# EAGLE design LEDBoard (EAGLE 7.5.0)
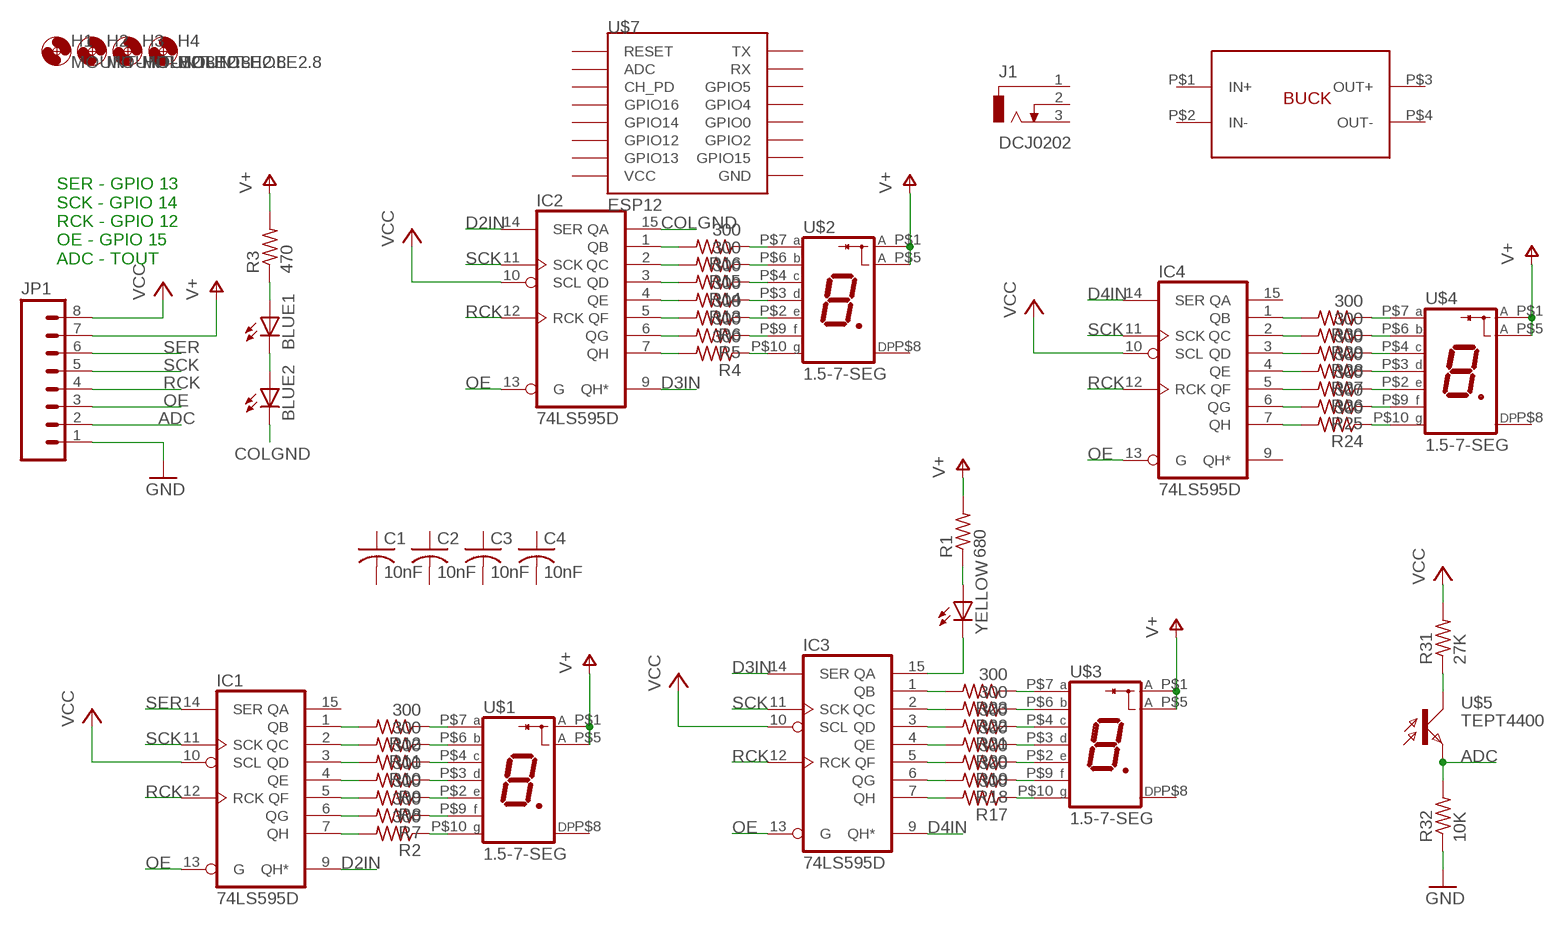
[diagram p0: schematic, sheet 1]

## Parts
BLUE1  LED3MM  [LED3MM]
BLUE2  LED3MM  [LED3MM]
C1  10nF  C-USC0805K  [C0805K]
C2  10nF  C-USC0805K  [C0805K]
C3  10nF  C-USC0805K  [C0805K]
C4  10nF  C-USC0805K  [C0805K]
H1  MOUNT-HOLE2.8  [2,8]
H2  MOUNT-HOLE2.8  [2,8]
H3  MOUNT-HOLE2.8  [2,8]
H4  MOUNT-HOLE2.8  [2,8]
IC1  74LS595D  [SO16]
IC2  74LS595D  [SO16]
IC3  74LS595D  [SO16]
IC4  74LS595D  [SO16]
J1  DCJ0202  [DCJ0202]
JP1  M08SMD-MALE  [1X08_SMD_MALE]
R1  680  R-US_M0805  [M0805]
R2  300  R-US_M0805  [M0805]
R3  470  R-US_M0805  [M0805]
R4  300  R-US_M0805  [M0805]
R5  300  R-US_M0805  [M0805]
R6  300  R-US_M0805  [M0805]
R7  300  R-US_M0805  [M0805]
R8  300  R-US_M0805  [M0805]
R9  300  R-US_M0805  [M0805]
R10  300  R-US_M0805  [M0805]
R11  300  R-US_M0805  [M0805]
R12  300  R-US_M0805  [M0805]
R13  300  R-US_M0805  [M0805]
R14  300  R-US_M0805  [M0805]
R15  300  R-US_M0805  [M0805]
R16  300  R-US_M0805  [M0805]
R17  300  R-US_M0805  [M0805]
R18  300  R-US_M0805  [M0805]
R19  300  R-US_M0805  [M0805]
R20  300  R-US_M0805  [M0805]
R21  300  R-US_M0805  [M0805]
R22  300  R-US_M0805  [M0805]
R23  300  R-US_M0805  [M0805]
R24  300  R-US_M0805  [M0805]
R25  300  R-US_M0805  [M0805]
R26  300  R-US_M0805  [M0805]
R27  300  R-US_M0805  [M0805]
R28  300  R-US_M0805  [M0805]
R29  300  R-US_M0805  [M0805]
R30  300  R-US_M0805  [M0805]
R31  27K  R-US_M0805  [M0805]
R32  10K  R-US_M0805  [M0805]
U$1  1.5-7-SEG  [1.5-7-SEG]
U$2  1.5-7-SEG  [1.5-7-SEG]
U$3  1.5-7-SEG  [1.5-7-SEG]
U$4  1.5-7-SEG  [1.5-7-SEG]
U$5  TEPT4400  [T1]
U$6  BUCK_CONV  [BUCK_CONV]
U$7  ESP12  [ESP12]
YELLOW  LED3MM  [LED3MM]

## Nets
ADC: JP1.2 R32.2 U$5.A(E)
COLGND: BLUE2.K(C) IC2.15(QA)
D2IN: IC1.9(QH*) IC2.14(SER)
D3IN: IC2.9(QH*) IC3.14(SER)
D4IN: IC3.9(QH*) IC4.14(SER)
GND: JP1.1 R32.1
N$1: IC1.1(QB) R12.2
N$2: R1.1 YELLOW.A
N$3: BLUE1.A R3.1
N$4: BLUE1.K(C) BLUE2.A
N$5: R12.1 U$1.P$7(A)
N$6: IC1.2(QC) R11.2
N$7: R11.1 U$1.P$6(B)
N$8: IC1.3(QD) R10.2
N$9: R10.1 U$1.P$4(C)
N$10: IC1.4(QE) R9.2
N$11: R9.1 U$1.P$3(D)
N$12: IC1.5(QF) R8.2
N$13: R8.1 U$1.P$2(E)
N$14: IC1.6(QG) R7.2
N$15: R7.1 U$1.P$9(F)
N$16: IC1.7(QH) R2.2
N$17: R2.1 U$1.P$10(G)
N$18: IC2.1(QB) R16.2
N$19: R16.1 U$2.P$7(A)
N$20: IC2.2(QC) R15.2
N$21: R31.1 U$5.K(C)
N$22: R15.1 U$2.P$6(B)
N$23: IC2.3(QD) R14.2
N$24: R14.1 U$2.P$4(C)
N$25: IC2.4(QE) R13.2
N$26: R13.1 U$2.P$3(D)
N$27: IC2.5(QF) R6.2
N$28: R6.1 U$2.P$2(E)
N$29: IC2.6(QG) R5.2
N$30: R5.1 U$2.P$9(F)
N$31: IC2.7(QH) R4.2
N$32: R4.1 U$2.P$10(G)
N$33: IC3.1(QB) R23.2
N$34: R23.1 U$3.P$7(A)
N$35: IC3.2(QC) R22.2
N$36: R22.1 U$3.P$6(B)
N$37: IC3.3(QD) R21.2
N$38: R21.1 U$3.P$4(C)
N$39: IC3.4(QE) R20.2
N$40: R20.1 U$3.P$3(D)
N$41: IC3.5(QF) R19.2
N$42: R19.1 U$3.P$2(E)
N$43: IC3.6(QG) R18.2
N$44: R18.1 U$3.P$9(F)
N$45: IC3.7(QH) R17.2
N$46: R17.1 U$3.P$10(G)
N$47: IC4.1(QB) R30.2
N$48: R30.1 U$4.P$7(A)
N$49: IC4.2(QC) R29.2
N$50: R29.1 U$4.P$6(B)
N$51: IC4.3(QD) R28.2
N$52: R28.1 U$4.P$4(C)
N$53: IC4.4(QE) R27.2
N$54: R27.1 U$4.P$3(D)
N$55: IC4.5(QF) R26.2
N$56: R26.1 U$4.P$2(E)
N$57: IC4.6(QG) R25.2
N$58: R25.1 U$4.P$9(F)
N$59: IC4.7(QH) R24.2
N$60: R24.1 U$4.P$10(G)
N$61: IC3.15(QA) YELLOW.K(C)
OE: IC1.13(G) IC2.13(G) IC3.13(G) IC4.13(G) JP1.3
RCK: IC1.12(RCK) IC2.12(RCK) IC3.12(RCK) IC4.12(RCK) JP1.4
SCK: IC1.11(SCK) IC2.11(SCK) IC3.11(SCK) IC4.11(SCK) JP1.5
SER: IC1.14(SER) JP1.6
V+: JP1.7 R1.2 R3.2 U$1.P$1(A) U$1.P$5(A) U$2.P$1(A) U$2.P$5(A) U$3.P$1(A) U$3.P$5(A) U$4.P$1(A) U$4.P$5(A)
VCC: IC1.10(SCL) IC2.10(SCL) IC3.10(SCL) IC4.10(SCL) JP1.8 R31.2
Unconnected: C1.1 C1.2 C2.1 C2.2 C3.1 C3.2 C4.1 C4.2 IC1.15(QA) IC4.9(QH*) IC4.15(QA) J1.1 J1.2 J1.3 U$1.P$8(DP) U$2.P$8(DP) U$3.P$8(DP) U$4.P$8(DP) U$6.P$1(IN+) U$6.P$2(IN-) U$6.P$3(OUT+) U$6.P$4(OUT-) U$7.ADC U$7.CH_PD U$7.GND U$7.GPIO0 U$7.GPIO2 U$7.GPIO4 U$7.GPIO5 U$7.GPIO12 U$7.GPIO13 U$7.GPIO14 U$7.GPIO15 U$7.GPIO16 U$7.RESET U$7.RX U$7.TX U$7.VCC

## Notes on the sheet
- SER - GPIO 13
  SCK - GPIO 14
  RCK - GPIO 12
  OE - GPIO 15
  ADC - TOUT

## Power pins joined to a net without a drawn wire
GND: IC1.8(GND) IC2.8(GND) IC3.8(GND) IC4.8(GND)
VCC: IC1.16(VCC) IC2.16(VCC) IC3.16(VCC) IC4.16(VCC)

## Library data of the parts
BLUE1 BLUE2 YELLOW = led:LED: LED OSRAM: - CHIPLED LG R971, LG N971, LY N971, LG Q971, LY Q971, LO R971, LY R971 LH N974, LH R974 LS Q976, LO Q976, LY Q976 LO Q996 - Hyper CHIPLED LW Q18S LB Q993, LB Q99A, LB R99A - SideLED LS A670, LO A670, LY A670, LG A670, LP A670 LB A673, LV A673, LT A673, LW A673 LH A674 LY A675 LS A676, LA A676, LO A676, LY A676, LW A676 LS A679, LY A679, LG A679 - Hyper Micro SIDELED® LS Y876, LA Y876, LO Y876, LY Y876 LT Y87S - SmartLED LW L88C, LW L88S LB L89C, LB L89S, LG L890 LS L89K, LO L89K, LY L89K LS L896, LA L896, LO L896, LY L896 - TOPLED LS T670, LO T670, LY T670, LG T670, LP T670 LSG T670, LSP T670, LSY T670, LOP T670, LYG T670 LG T671, LOG T671, LSG T671 LB T673, LV T673, LT T673, LW T673 LH T674 LS T676, LA T676, LO T676, LY T676, LB T676, LH T676, LSB T676, LW T676 LB T67C, LV T67C, LT T67C, LS T67K, LO T67K, LY T67K, LW E67C LS E67B, LA E67B, LO E67B, LY E67B, LB E67C, LV E67C, LT E67C LW T67C LS T679, LY T679, LG T679 LS T770, LO T770, LY T770, LG T770, LP T770 LB T773, LV T773, LT T773, LW T773 LH T774 LS E675, LA E675, LY E675, LS T675 LS T776, LA T776, LO T776, LY T776, LB T776 LHGB T686 LT T68C, LB T68C - Hyper Mini TOPLED® LB M676 - Mini TOPLED Santana® LG M470 LS M47K, LO M47K, LY M47K Source: http://www.osram.convergy.de LUXEON: - LUMILED® LXK2-PW12-R00, LXK2-PW12-S00, LXK2-PW14-U00, LXK2-PW14-V00 LXK2-PM12-R00, LXK2-PM12-S00, LXK2-PM14-U00 LXK2-PE12-Q00, LXK2-PE12-R00, LXK2-PE12-S00, LXK2-PE14-T00, LXK2-PE14-U00 LXK2-PB12-K00, LXK2-PB12-L00, LXK2-PB12-M00, LXK2-PB14-N00, LXK2-PB14-P00, LXK2-PB14-Q00 LXK2-PR12-L00, LXK2-PR12-M00, LXK2-PR14-Q00, LXK2-PR14-R00 LXK2-PD12-Q00, LXK2-PD12-R00, LXK2-PD12-S00 LXK2-PH12-R00, LXK2-PH12-S00 LXK2-PL12-P00, LXK2-PL12-Q00, LXK2-PL12-R00 Source: www.luxeon.com KINGBRIGHT: KA-3528ASYC Source: www.kingbright.com
C1-C4 = rcl:C-US: CAPACITOR, American symbol
H1-H4 = holes:MOUNT-HOLE: MOUNTING HOLE with drill center marker
IC1-IC4 = 74xx-us:74*595: 8-bit SHIFT REGISTER, output latch
J1 = con-jack:DCJ0202: DC POWER JACK Source: DCJ0202.pdf; OC_FARNELL: unknown; OC_NEWARK: unknown
JP1 = SparkFun-Connectors:M08: Header 8 Standard 8-pin 0.1" header. Use with straight break away headers (SKU : PRT-00116), right angle break away headers (PRT-00553), swiss pins (PRT-00743), machine pins (PRT-00117), and female headers (PRT-00115).; PROD_ID: CONN-11292
R1-R32 = rcl:R-US_: RESISTOR, American symbol
U$1-U$4 = KevinsLib:1.5-7-SEG
U$5 = KevinsLib:TEPT4400
U$6 = KevinsLib:BUCK_CONV
U$7 = KevinsLib:ESP12: ESP8266 Wifi module 12

## Board
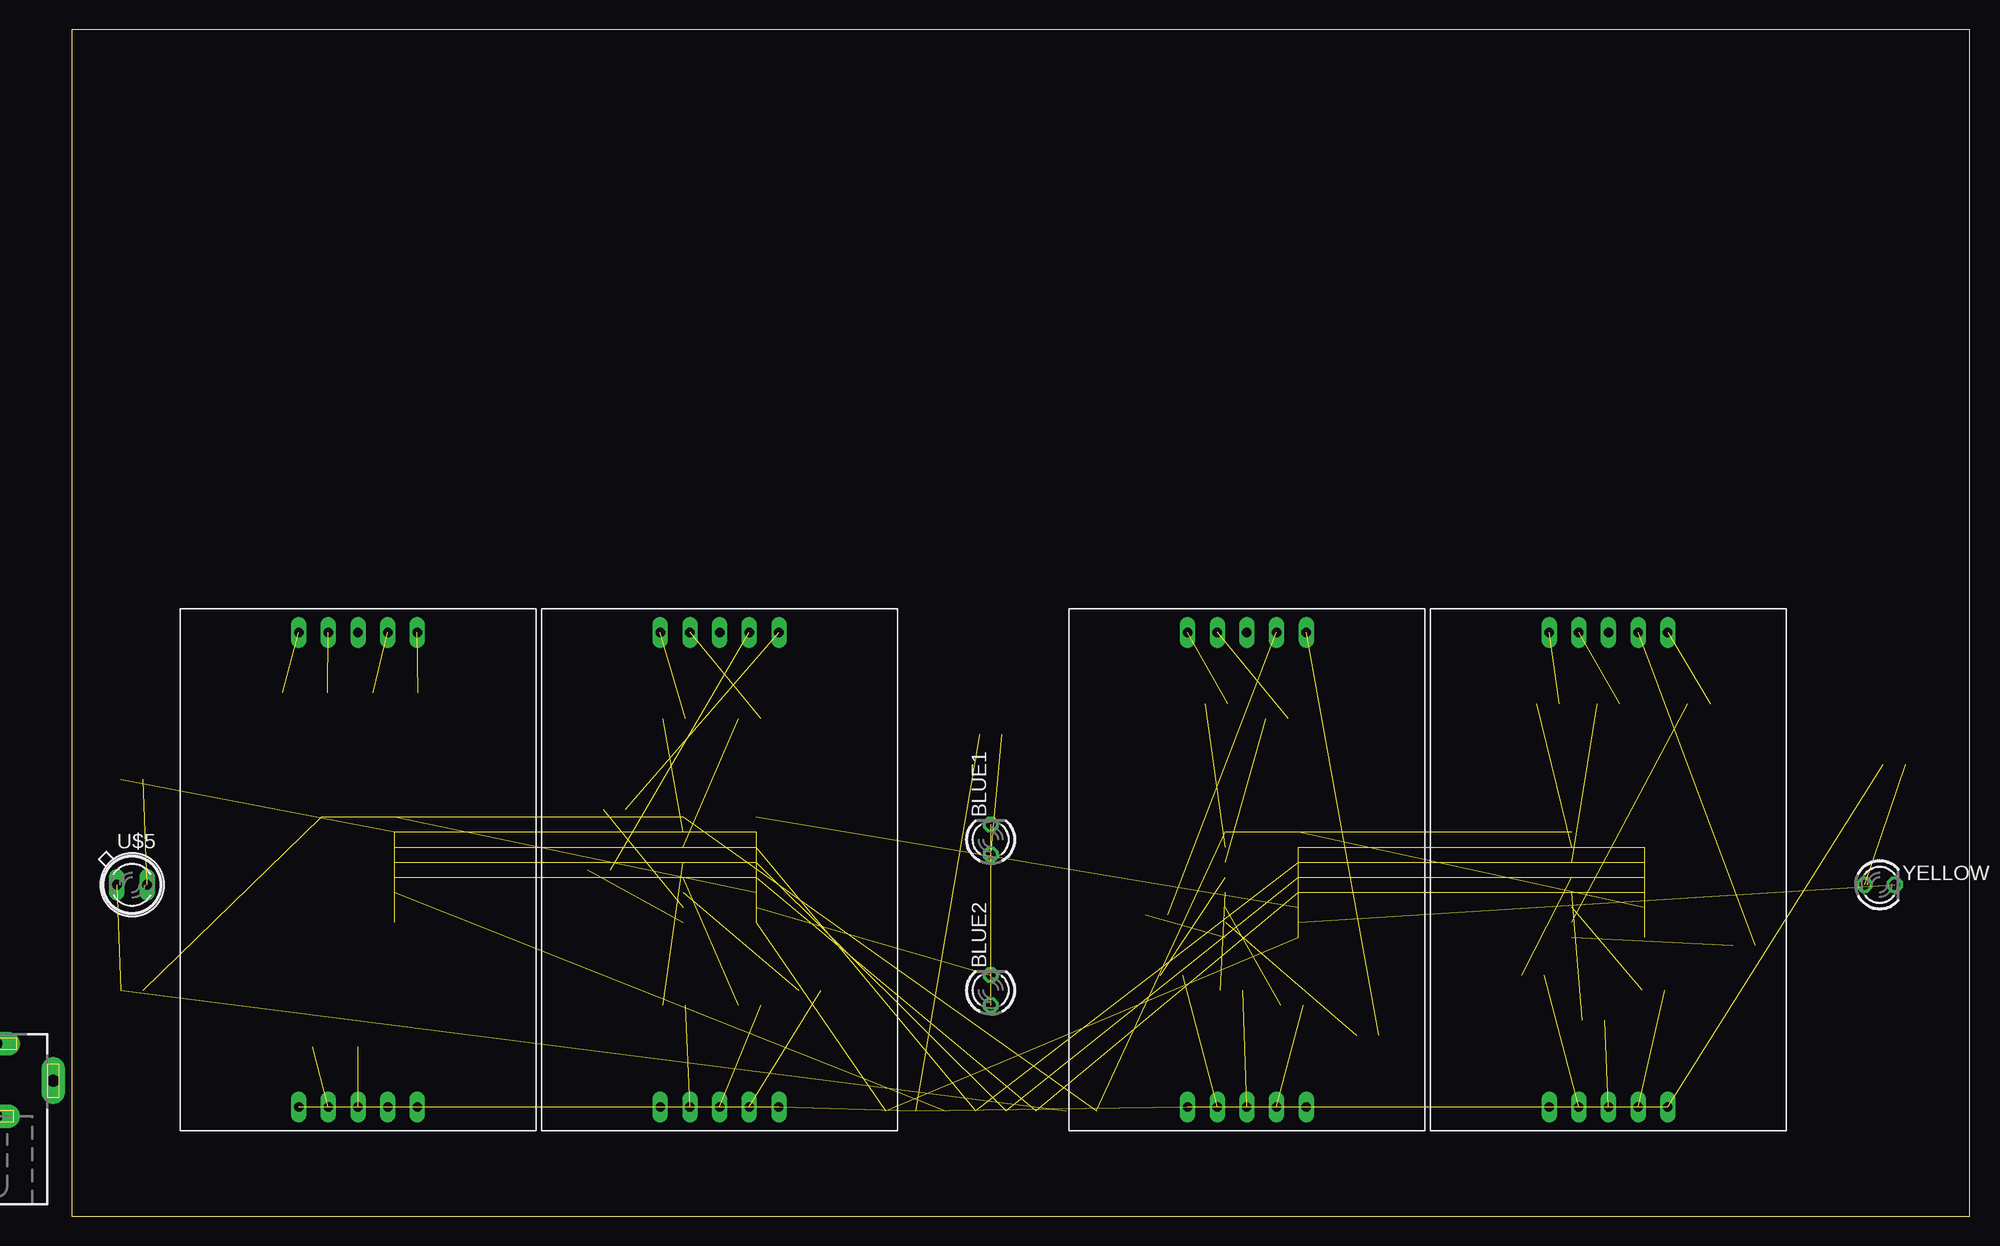
[diagram p1: board, top side]
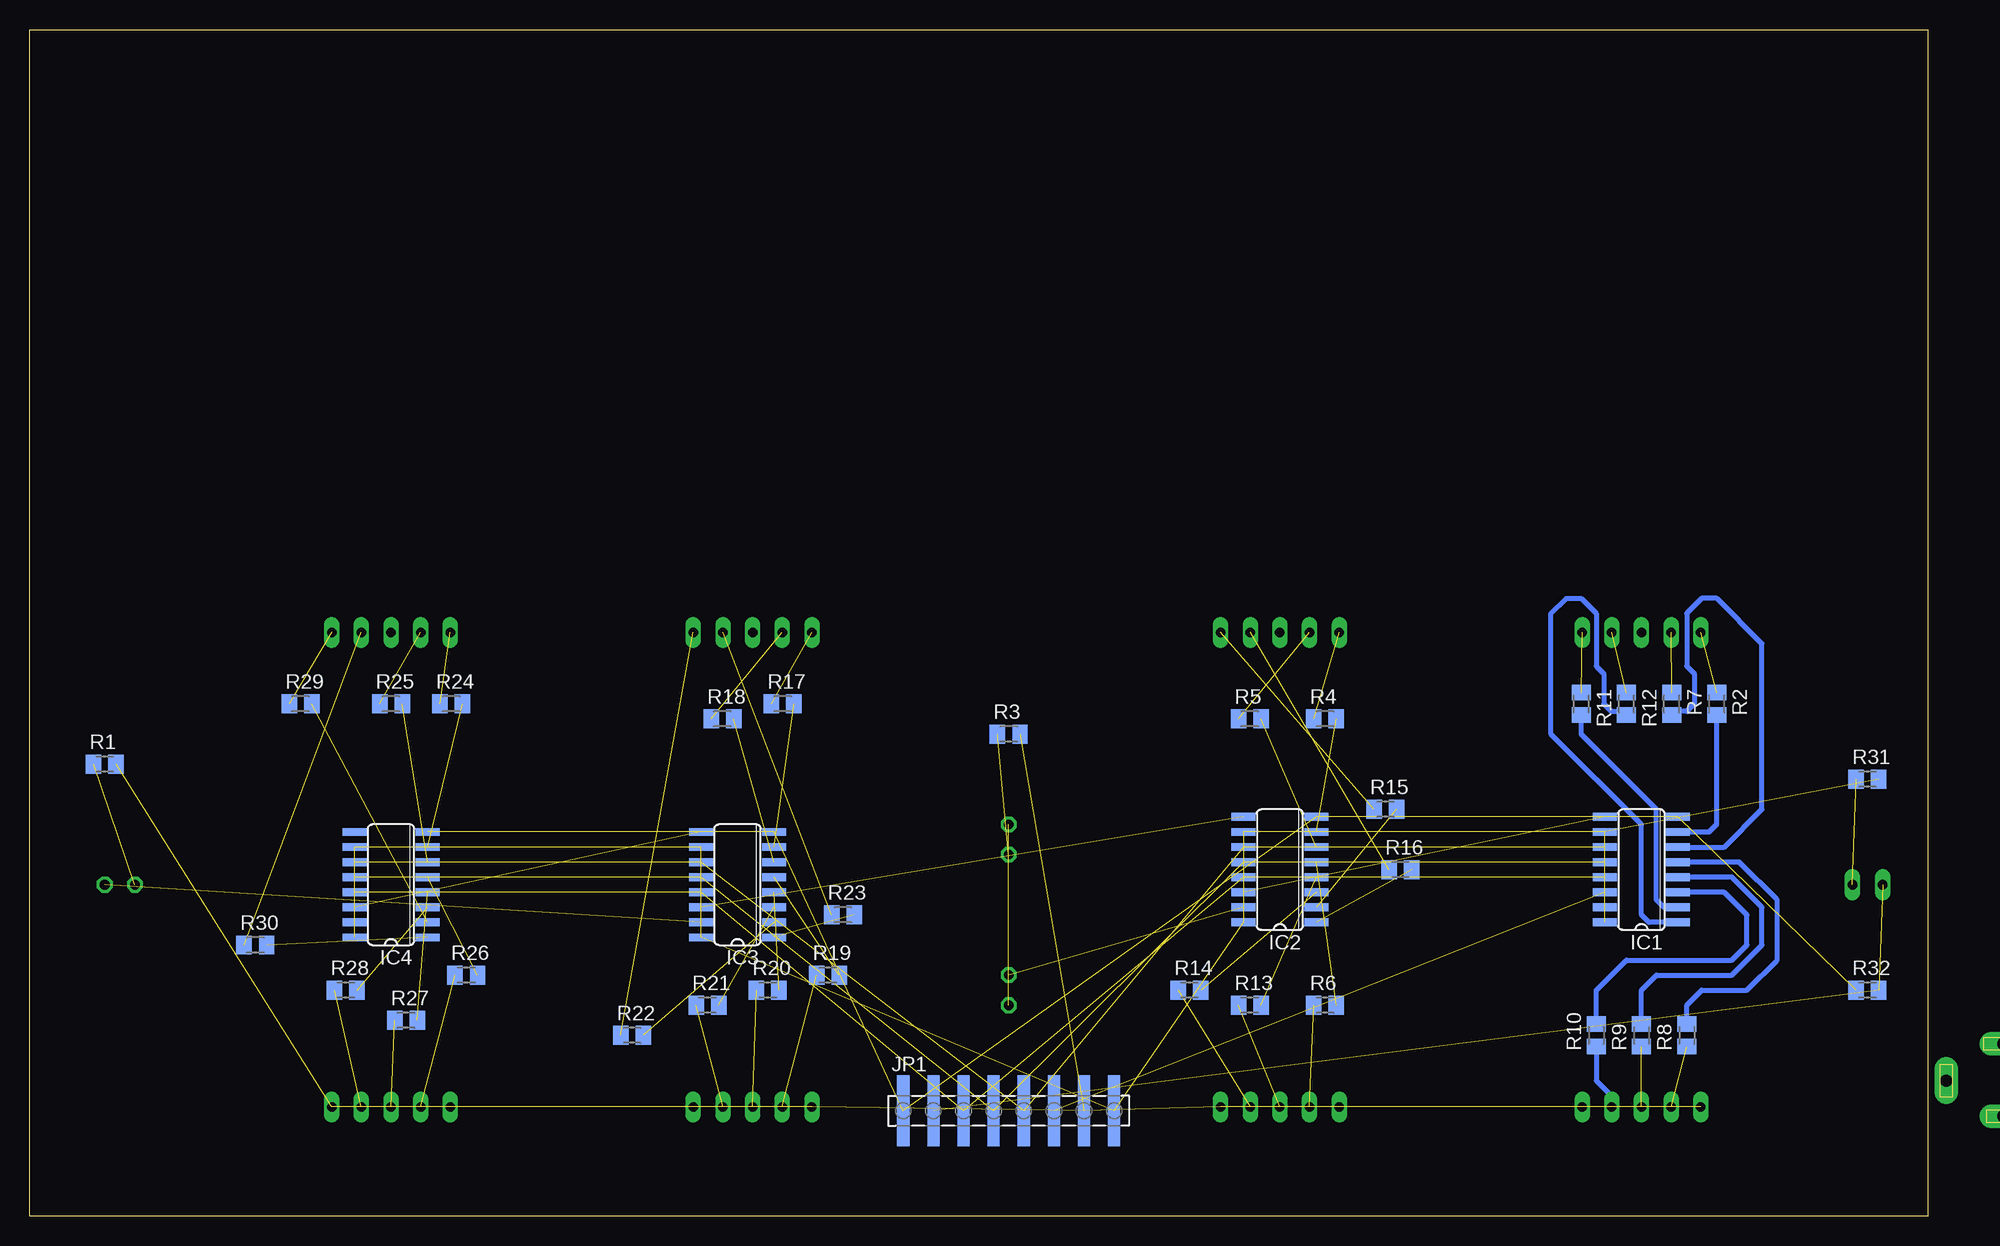
[diagram p2: board, bottom side, seen from below]

Size 160 x 100 mm. Coordinates in mm from the lower left corner, seen from the top.
Outline: 0,0 160,0 160,100 0,100 0,0
Copper layers (1*16): Top 0.035mm / dielectric 1.5mm / Bottom 0.035mm
Design rules "default": minimum track width 10mil, minimum drill 24mil, track to track 8mil, track to pad 8mil, pad to pad 8mil, via to via 8mil, smd to smd 8mil, copper to edge 40mil, drill to drill 8mil, minimum pad ring 10mil, minimum via ring 8mil, stop-mask expansion 4mil, vias tented up to drill 0mil, thermal gap 10mil

### Footprints (pad centres in the part's own frame; a part is rotated, then mirrored left to right if it is on the bottom)
LED3MM = drill 0.813 octagon: A -1.27,0; K 1.27,0
C0805K = smd 1.3 x 1.6: 1 -1,0; 2 1,0
2,8 = hole 2.8: 0,0
SO16 = smd 0.66 x 2.032: 1 -4.445,-3.073; 2 -3.175,-3.073; 3 -1.905,-3.073; 4 -0.635,-3.073; 5 0.635,-3.073; 6 1.905,-3.073; 7 3.175,-3.073; 8 4.445,-3.073; 9 4.445,3.073; 10 3.175,3.073; 11 1.905,3.073; 12 0.635,3.073; 13 -0.635,3.073; 14 -1.905,3.073; 15 -3.175,3.073; 16 -4.445,3.073
DCJ0202 = drill 1 pad 2 long: 1 0,3.1; 2 4.8,0; 3 0,-3
1X08_SMD_MALE = smd 1.02 x 6: 1 0,0; 2 2.54,0; 3 5.08,0; 4 7.62,0; 5 10.16,0; 6 12.7,0; 7 15.24,0; 8 17.78,0
M0805 = smd 1.3 x 1.6: 1 -0.95,0; 2 0.95,0
1.5-7-SEG = drill 0.8 long: P$1 -5,-20; P$2 -2.5,-20; P$3 0,-20; P$4 2.5,-20; P$5 5,-20; P$6 5,20; P$7 2.5,20; P$8 0,20; P$9 -2.5,20; P$10 -5,20
T1 = drill 0.813 long: A -1.27,0; K 1.27,0
BUCK_CONV = drill 0.8 pad 2.54 long: P$1 -20.066,8.89; P$2 -20.066,-8.89; P$3 20.066,8.89; P$4 20.066,-8.89
ESP12 = smd 2.54 x 1.27: ADC -7.71,3.81; CH_PD -7.71,1.81; GND 7.6,-8.16; GPIO0 7.6,-2.16; GPIO2 7.6,-4.16; GPIO4 7.6,-0.16; GPIO5 7.6,1.84; GPIO12 -7.71,-4.19; GPIO13 -7.71,-6.19; GPIO14 -7.71,-2.19; GPIO15 7.6,-6.16; GPIO16 -7.71,-0.19; RESET -7.71,5.81; RX 7.6,3.84; TX 7.6,5.84; VCC -7.71,-8.19

### Placement (x,y rotation side)
BLUE1  77.47,31.75 90 top
BLUE2  77.47,19.05 90 top
C1  -29.21,-55.88 0 top  (outside the outline)
C2  -29.21,-59.69 0 top  (outside the outline)
C3  -29.21,-63.5 0 top  (outside the outline)
C4  -29.21,-67.31 0 top  (outside the outline)
H1  -8.89,-3.81 0 top  (outside the outline)
H2  -8.89,-11.43 0 top  (outside the outline)
H3  -8.89,-19.05 0 top  (outside the outline)
H4  -8.89,-26.67 0 top  (outside the outline)
IC1  24.13,29.21 90 bottom
IC2  54.61,29.21 90 bottom
IC3  100.33,27.94 90 bottom
IC4  129.54,27.94 90 bottom
J1  -6.35,11.43 0 top
JP1  86.36,8.89 0 bottom
R1  153.67,38.1 0 bottom
R2  17.78,43.18 270 bottom
R3  77.47,40.64 0 bottom
R4  50.8,41.91 0 bottom
R5  57.15,41.91 0 bottom
R6  50.8,17.78 0 bottom
R7  21.59,43.18 270 bottom
R8  20.32,15.24 90 bottom
R9  24.13,15.24 90 bottom
R10  27.94,15.24 90 bottom
R11  29.21,43.18 270 bottom
R12  25.4,43.18 270 bottom
R13  57.15,17.78 0 bottom
R14  62.23,19.05 0 bottom
R15  45.72,34.29 0 bottom
R16  44.45,29.21 0 bottom
R17  96.52,43.18 0 bottom
R18  101.6,41.91 0 bottom
R19  92.71,20.32 0 bottom
R20  97.79,19.05 0 bottom
R21  102.87,17.78 0 bottom
R22  109.22,15.24 0 bottom
R23  91.44,25.4 0 bottom
R24  124.46,43.18 0 bottom
R25  129.54,43.18 0 bottom
R26  123.19,20.32 0 bottom
R27  128.27,16.51 0 bottom
R28  133.35,19.05 0 bottom
R29  137.16,43.18 0 bottom
R30  140.97,22.86 0 bottom
R31  5.08,36.83 0 bottom
R32  5.08,19.05 0 bottom
U$1  24.13,29.21 0 top
U$2  54.61,29.21 0 top
U$3  99.06,29.21 0 top
U$4  129.54,29.21 0 top
U$5  5.08,27.94 0 top
U$6  10.16,-41.91 0 top  (outside the outline)
U$7  -22.86,-39.37 0 top  (outside the outline)
YELLOW  152.4,27.94 0 top

### Tracks (layer width: path | path; a pad name or v marks a point on that pad's centre or on a via)
ADC  (2 unrouted)
COLGND  (1 unrouted)
D2IN  (1 unrouted)
D3IN  (1 unrouted)
D4IN  (1 unrouted)
GND  (5 unrouted)
N$1
  Bottom 0.406: IC1.1 23.5,24.77 24.13,25.4 24.13,33.02 31.75,40.64 31.75,50.8 30.48,52.07 29.21,52.07 27.94,50.8 27.94,46.35 27.3,45.72 27.3,43.18 26.67,42.55 25.71,42.55 R12.2
N$2  (1 unrouted)
N$3  (1 unrouted)
N$4  (1 unrouted)
N$5  (1 unrouted)
N$6
  Bottom 0.406: IC1.2 22.23,26.04 22.86,26.67 22.86,34.29 29.21,40.64 R11.2
N$7  (1 unrouted)
N$8
  Bottom 0.406: R10.2 27.94,19.05 25.4,21.59 16.51,21.59 15.24,22.86 15.24,25.4 17.14,27.3 IC1.3
N$9
  Bottom 0.406: R10.1 27.94,11.43 26.67,10.16 26.67,9.25 U$1.P$4
N$10
  Bottom 0.406: R9.2 24.13,19.05 22.86,20.32 16.51,20.32 13.97,22.86 13.97,26.04 16.51,28.57 IC1.4
N$11  (1 unrouted)
N$12
  Bottom 0.406: R8.2 20.32,17.78 19.05,19.05 15.24,19.05 12.7,21.59 12.7,26.67 15.88,29.84 IC1.5
N$13  (1 unrouted)
N$14
  Bottom 0.406: IC1.6 17.14,31.11 13.97,34.29 13.97,48.26 17.78,52.07 19.05,52.07 20.32,50.8 20.32,46.35 19.68,45.72 19.68,43.18 20.32,42.55 21.27,42.55 R7.2
N$15  (1 unrouted)
N$16
  Bottom 0.406: IC1.7 18.41,32.38 17.78,33.02 R2.2
N$17  (1 unrouted)
N$18  (1 unrouted)
N$19  (1 unrouted)
N$20  (1 unrouted)
N$21  (1 unrouted)
N$22  (1 unrouted)
N$23  (1 unrouted)
N$24  (1 unrouted)
N$25  (1 unrouted)
N$26  (1 unrouted)
N$27  (1 unrouted)
N$28  (1 unrouted)
N$29  (1 unrouted)
N$30  (1 unrouted)
N$31  (1 unrouted)
N$32  (1 unrouted)
N$33  (1 unrouted)
N$34  (1 unrouted)
N$35  (1 unrouted)
N$36  (1 unrouted)
N$37  (1 unrouted)
N$38  (1 unrouted)
N$39  (1 unrouted)
N$40  (1 unrouted)
N$41  (1 unrouted)
N$42  (1 unrouted)
N$43  (1 unrouted)
N$44  (1 unrouted)
N$45  (1 unrouted)
N$46  (1 unrouted)
N$47  (1 unrouted)
N$48  (1 unrouted)
N$49  (1 unrouted)
N$50  (1 unrouted)
N$51  (1 unrouted)
N$52  (1 unrouted)
N$53  (1 unrouted)
N$54  (1 unrouted)
N$55  (1 unrouted)
N$56  (1 unrouted)
N$57  (1 unrouted)
N$58  (1 unrouted)
N$59  (1 unrouted)
N$60  (1 unrouted)
N$61  (1 unrouted)
OE  (4 unrouted)
RCK  (4 unrouted)
SCK  (4 unrouted)
SER  (1 unrouted)
V+  (10 unrouted)
VCC  (9 unrouted)